# EAGLE design Carolo_20200123 (EAGLE 7.7.0)
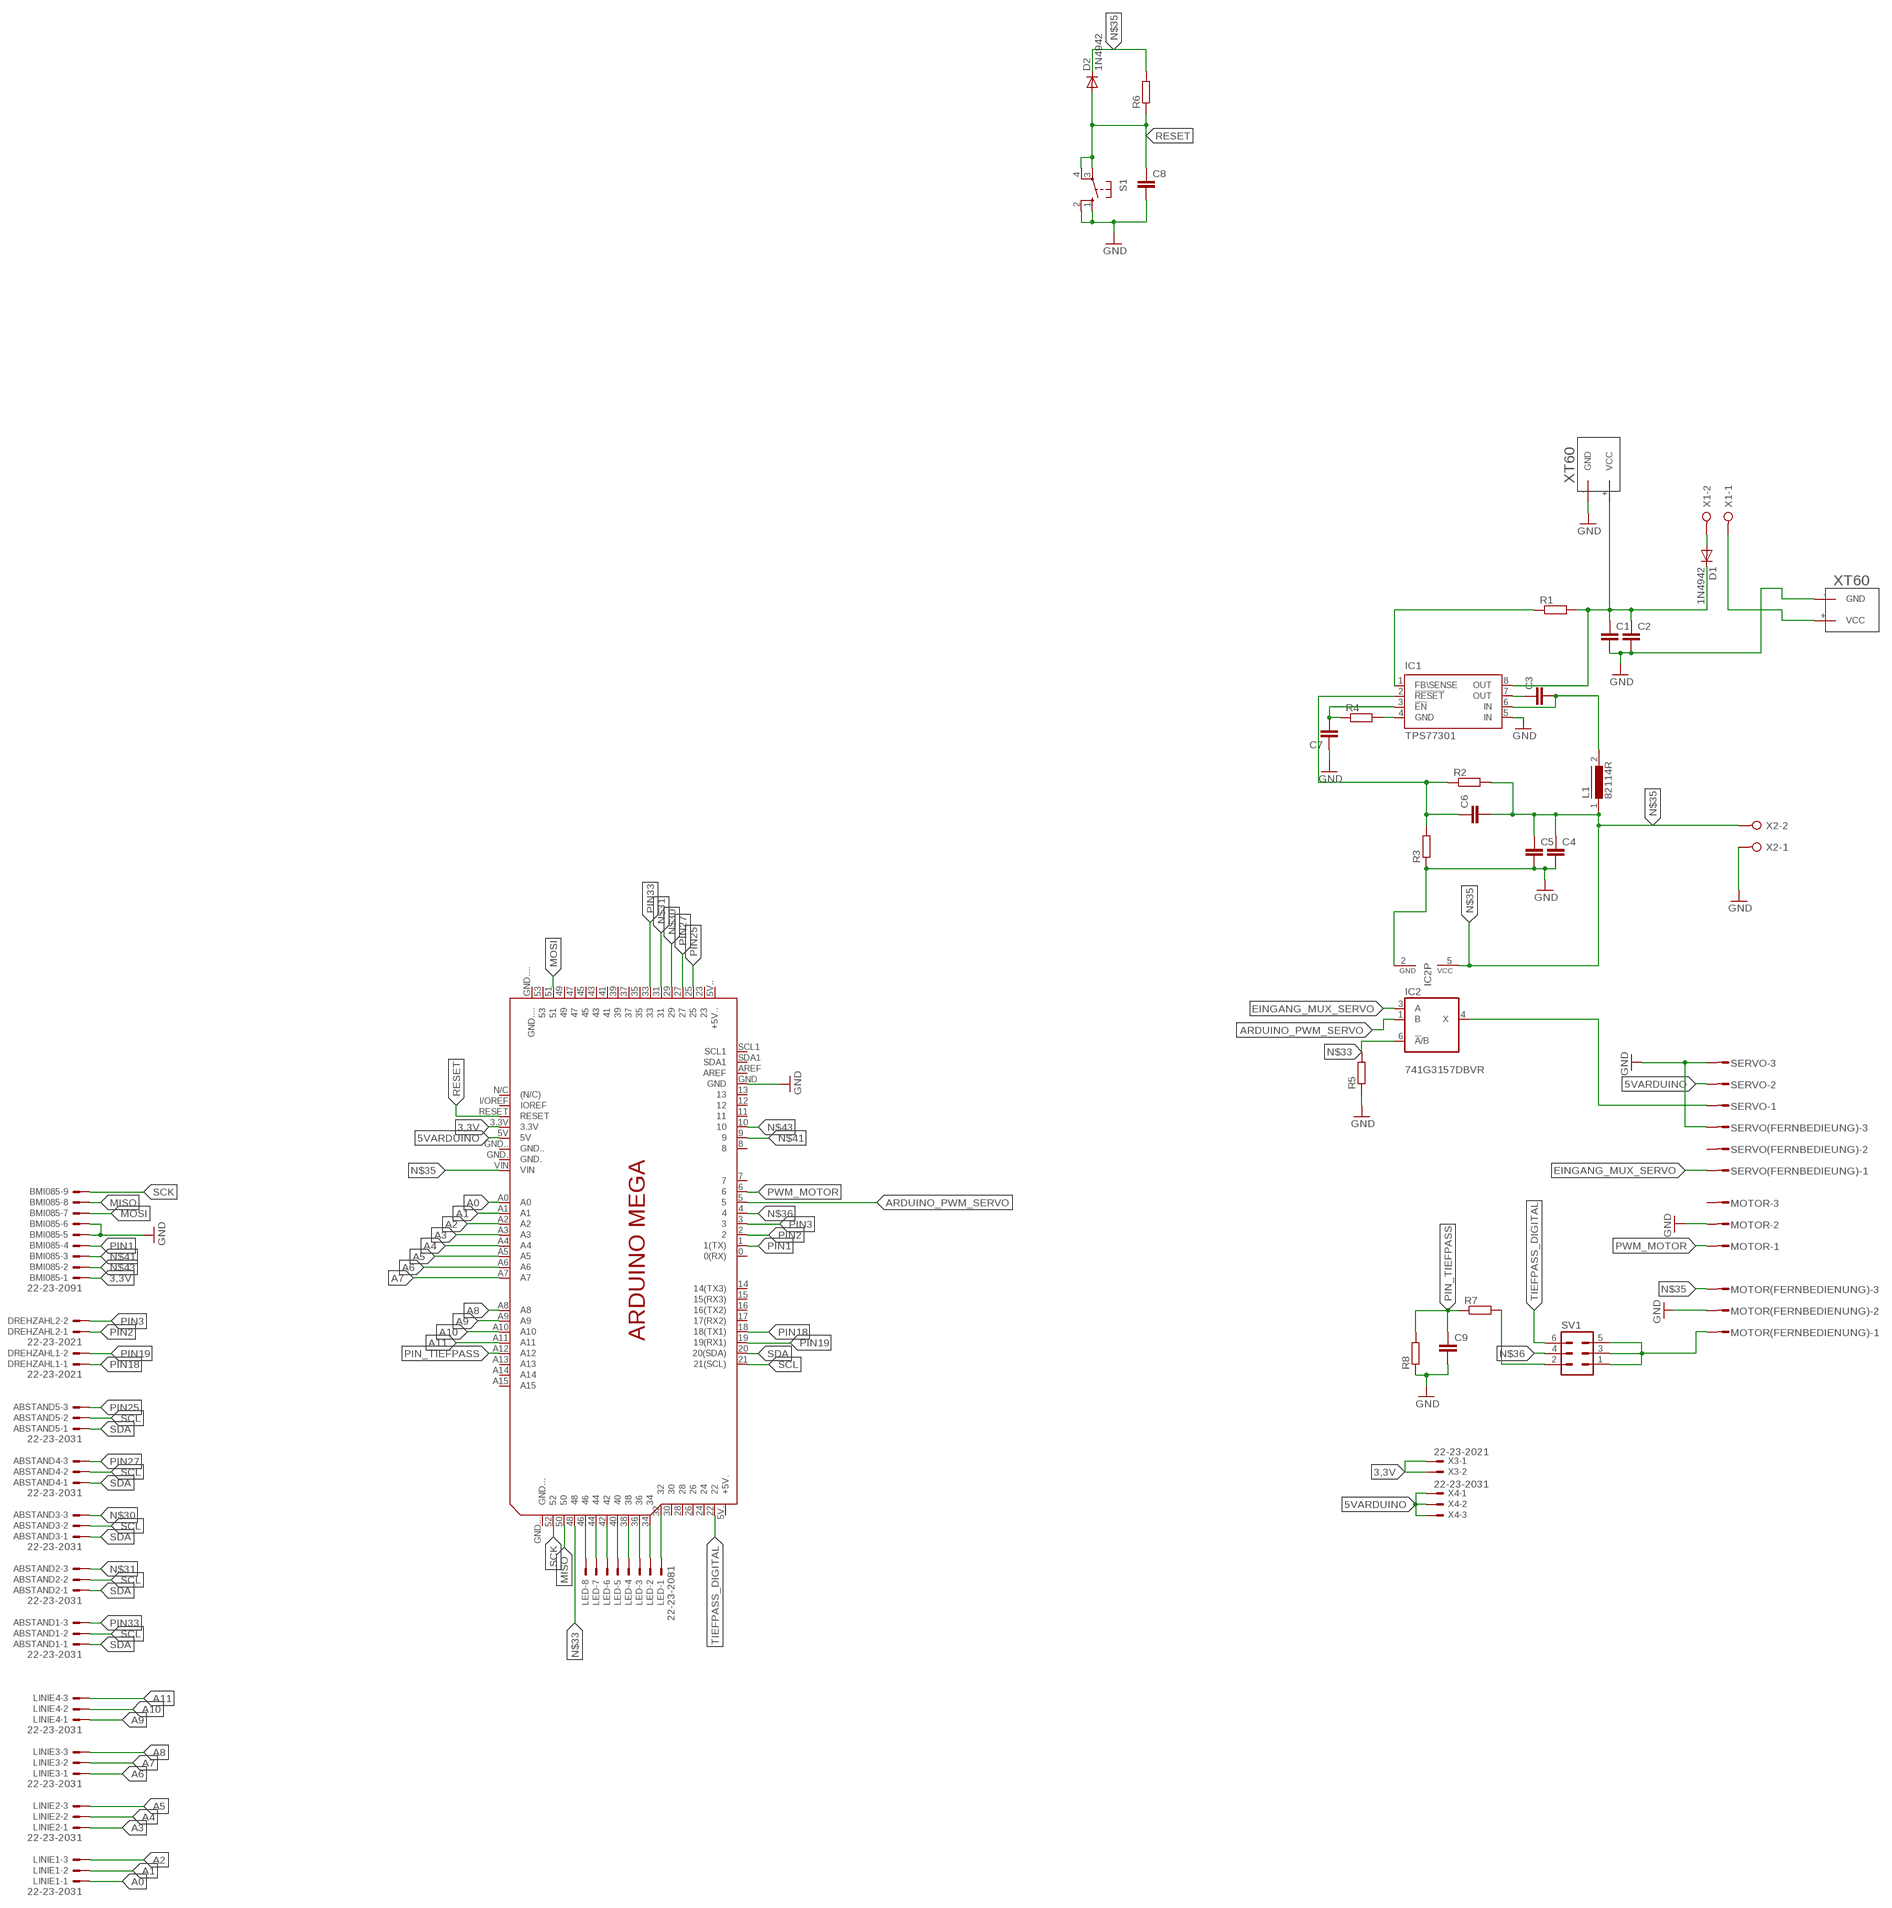
[diagram p0: schematic, sheet 1]

## Parts
ABSTAND1  22-23-2031  [22-23-2031]
ABSTAND2  22-23-2031  [22-23-2031]
ABSTAND3  22-23-2031  [22-23-2031]
ABSTAND4  22-23-2031  [22-23-2031]
ABSTAND5  22-23-2031  [22-23-2031]
BMI085  22-23-2091  [22-23-2091]
C1  C2,5-3  [C2.5-3]
C2  C2,5-3  [C2.5-3]
C3  C2,5-3  [C2.5-3]
C4  C2,5-3  [C2.5-3]
C5  C2,5-3  [C2.5-3]
C6  C2,5-3  [C2.5-3]
C7  C2,5-3  [C2.5-3]
C8  C2,5-3  [C2.5-3]
C9  C2,5-3  [C2.5-3]
D1  1N4942  [DO41-10]
D2  1N4942  [DO41-10]
DREHZAHL1  22-23-2021  [22-23-2021]
DREHZAHL2  22-23-2021  [22-23-2021]
IC1  TPS77301  [SOP-08]
IC2  741G3157DBVR  [DBV_R-PDSO-G6]
L1  82114R  [82114R]
LED  22-23-2081  [22-23-2081]
LINIE1  22-23-2031  [22-23-2031]
LINIE2  22-23-2031  [22-23-2031]
LINIE3  22-23-2031  [22-23-2031]
LINIE4  22-23-2031  [22-23-2031]
MOTOR  L03P  [L03P]
MOTOR(FERNBEDIENUNG)  L03P  [L03P]
PCB1  ARDUINO_MEGA  [ARDUINO_MEGA]
R1  R-EU_0411/15  [0411/15]
R2  R-EU_0411/15  [0411/15]
R3  R-EU_0411/15  [0411/15]
R4  R-EU_0411/15  [0411/15]
R5  R-EU_0411/15  [0411/15]
R6  R-EU_0411/15  [0411/15]
R7  R-EU_0411/15  [0411/15]
R8  R-EU_0411/15  [0411/15]
S1  10-XX  [B3F-10XX]
SERVO  L03P  [L03P]
SERVO(FERNBEDIEUNG)  L03P  [L03P]
SV1  ML6  [ML6]
U$1  XT60  [XT60]
U$2  XT60  [XT60]
X1  W237-02P  [W237-132]
X2  W237-02P  [W237-132]
X3  22-23-2021  [22-23-2021]
X4  22-23-2031  [22-23-2031]

## Nets
3,3V: BMI085.1 PCB1.3.3V X3.1 X3.2
5VARDUINO: PCB1.5V SERVO.2 X4.1 X4.2 X4.3
A0: LINIE1.1 PCB1.A0
A1: LINIE1.2 PCB1.A1
A2: LINIE1.3 PCB1.A2
A3: LINIE2.1 PCB1.A3
A4: LINIE2.2 PCB1.A4
A5: LINIE2.3 PCB1.A5
A6: LINIE3.1 PCB1.A6
A7: LINIE3.2 PCB1.A7
A8: LINIE3.3 PCB1.A8
A9: LINIE4.1 PCB1.A9
A10: LINIE4.2 PCB1.A10
A11: LINIE4.3 PCB1.A11
ARDUINO_PWM_SERVO: IC2.1(B) PCB1.5
EINGANG_MUX_SERVO: IC2.3(A) SERVO(FERNBEDIEUNG).1
GND: BMI085.5 BMI085.6 C1.2 C2.2 C4.2 C5.2 C7.1 C8.2 C9.2 IC1.5(IN) IC2.2(GND) MOTOR(FERNBEDIENUNG).2 MOTOR.2 PCB1.GND R3.1 R5.1 R8.1 S1.1(S) S1.2(S1) SERVO(FERNBEDIEUNG).3 SERVO.3 U$1.-(GND) U$2.-(GND) X2.1
MISO: BMI085.8 PCB1.50
MOSI: BMI085.7 PCB1.51
N$1: U$1.+(VCC) X1.1
N$4: R7.2 SV1.2
N$5: C6.1 IC1.2(!RESET) R2.1 R3.2
N$6: C3.1 IC1.7(OUT)
N$8: MOTOR(FERNBEDIENUNG).1 SV1.1 SV1.3 SV1.5
N$9: LED.1 PCB1.32
N$10: C3.2 IC1.6(IN) L1.2
N$12: C7.2 IC1.3(!EN) R4.1
N$13: IC2.4(X) SERVO.1
N$14: LED.2 PCB1.34
N$15: LED.3 PCB1.36
N$16: LED.4 PCB1.38
N$17: LED.5 PCB1.40
N$18: LED.6 PCB1.42
N$19: LED.7 PCB1.44
N$20: LED.8 PCB1.46
N$23: IC1.4(GND) R4.2
N$24: D1.A X1.2
N$27: C1.1 C2.1 D1.C IC1.8(OUT) R1.2 U$2.+(VCC)
N$30: ABSTAND3.3 PCB1.29
N$31: ABSTAND2.3 PCB1.31
N$32: IC1.1(FB\SENSE) R1.1
N$33: IC2.6(!A!/B) PCB1.48 R5.2
N$35: C4.1 C5.1 C6.2 D2.C IC2.5(VCC) L1.1 MOTOR(FERNBEDIENUNG).3 PCB1.VIN R2.2 R6.2 X2.2
N$36: PCB1.4 SV1.4
N$41: BMI085.3 PCB1.9
N$43: BMI085.2 PCB1.10
PIN1: BMI085.4 PCB1.1(1(TX))
PIN2: DREHZAHL2.1 PCB1.2
PIN3: DREHZAHL2.2 PCB1.3
PIN18: DREHZAHL1.1 PCB1.18(18(TX1))
PIN19: DREHZAHL1.2 PCB1.19(19(RX1))
PIN25: ABSTAND5.3 PCB1.25
PIN27: ABSTAND4.3 PCB1.27
PIN33: ABSTAND1.3 PCB1.33
PIN_TIEFPASS: C9.1 PCB1.A12 R7.1 R8.2
PWM_MOTOR: MOTOR.1 PCB1.6
RESET: C8.1 D2.A PCB1.RESET R6.1 S1.3(P) S1.4(P1)
SCK: BMI085.9 PCB1.52
SCL: ABSTAND1.2 ABSTAND2.2 ABSTAND3.2 ABSTAND4.2 ABSTAND5.2 PCB1.21(21(SCL))
SDA: ABSTAND1.1 ABSTAND2.1 ABSTAND3.1 ABSTAND4.1 ABSTAND5.1 PCB1.20(20(SDA))
TIEFPASS_DIGITAL: PCB1.22 SV1.6
Unconnected: MOTOR.3 PCB1.0(0(RX)) PCB1.5V.(+5V.) PCB1.5V..(+5V..) PCB1.7 PCB1.8 PCB1.11 PCB1.12 PCB1.13 PCB1.14(14(TX3)) PCB1.15(15(RX3)) PCB1.16(16(TX2)) PCB1.17(17(RX2)) PCB1.23 PCB1.24 PCB1.26 PCB1.28 PCB1.30 PCB1.35 PCB1.37 PCB1.39 PCB1.41 PCB1.43 PCB1.45 PCB1.47 PCB1.49 PCB1.53 PCB1.A13 PCB1.A14 PCB1.A15 PCB1.AREF PCB1.GND. PCB1.GND.. PCB1.GND... PCB1.GND.... PCB1.I/OREF(IOREF) PCB1.N/C((N/C)) PCB1.SCL1 PCB1.SDA1 SERVO(FERNBEDIEUNG).2

## Library data of the parts
ABSTAND1-ABSTAND5 LINIE1-LINIE4 X4 = con-molex:22-23-2031: .100" (2.54mm) Center Header - 3 Pin; MF: MOLEX; MPN: 22-23-2031; OC_FARNELL: 1462950; OC_NEWARK: 30C0862
BMI085 = con-molex:22-23-2091: .100" (2.54mm) Center Header - 9 Pin; MF: MOLEX; MPN: 22-23-2091; OC_FARNELL: 1756827; OC_NEWARK: 56H0450
C1-C9 = capacitor-wima:C: CAPACITOR naming: grid - package width
D1 D2 = diode:1N4942: DIODE 1.0 A, 200 V, 150 ns
DREHZAHL1 DREHZAHL2 X3 = con-molex:22-23-2021: .100" (2.54mm) Center Header - 2 Pin; MF: MOLEX; MPN: 22-23-2021; OC_FARNELL: 1462926; OC_NEWARK: 25C3832
IC1 = texas:TPS773*: 250-mA LDO REGULATORS WITH RESET OUTPUT WITH 8-PIN MSOP PACKAGING Source: http://focus.ti.com/lit/ds/symlink/tps77333.pdf; MF: TEXAS INSTRUMENT CONNECTORS; MPN: TPS77301DGK; OC_FARNELL: 1510194; OC_NEWARK: 77C1213
IC2 = 74xx-little-us:74*1G3157: Single-Pole, Double-Throw Analog Switch Source: http://focus.ti.com/lit/ds/symlink/sn74lvc1g3157.pdf
L1 = inductors:82114R: INDUCTOR
LED = con-molex:22-23-2081: .100" (2.54mm) Center Header - 8 Pin; MF: MOLEX; MPN: 22-23-2081; OC_FARNELL: 1756826; OC_NEWARK: 01C7592
MOTOR MOTOR(FERNBEDIENUNG) SERVO SERVO(FERNBEDIEUNG) = con-amp-mt:L03P: AMP MT CONNECTOR; OC_FARNELL: unknown; OC_NEWARK: unknown
PCB1 = Arduino_:ARDUINO_MEGA: Device for representing an Arduino Mega board with a footprint in an EAGLE design. Created by Dave Young for Element14. More EAGLE documentation at: http://www.element14.com/community/community/knode/cadsoft_eagle
R1-R8 = resistor:R-EU_: RESISTOR, European symbol
S1 = switch-omron:10-XX: OMRON SWITCH; MPN: B3F-1000; OC_FARNELL: 176432; OC_NEWARK: 36M3542
SV1 = con-harting-ml:ML6: HARTING; OC_FARNELL: unknown; OC_NEWARK: unknown
U$1 U$2 = XT60:XT60: XT60
X1 X2 = con-wago-508:W237-02P: WAGO SREW CLAMP; OC_FARNELL: unknown; OC_NEWARK: unknown

## Board
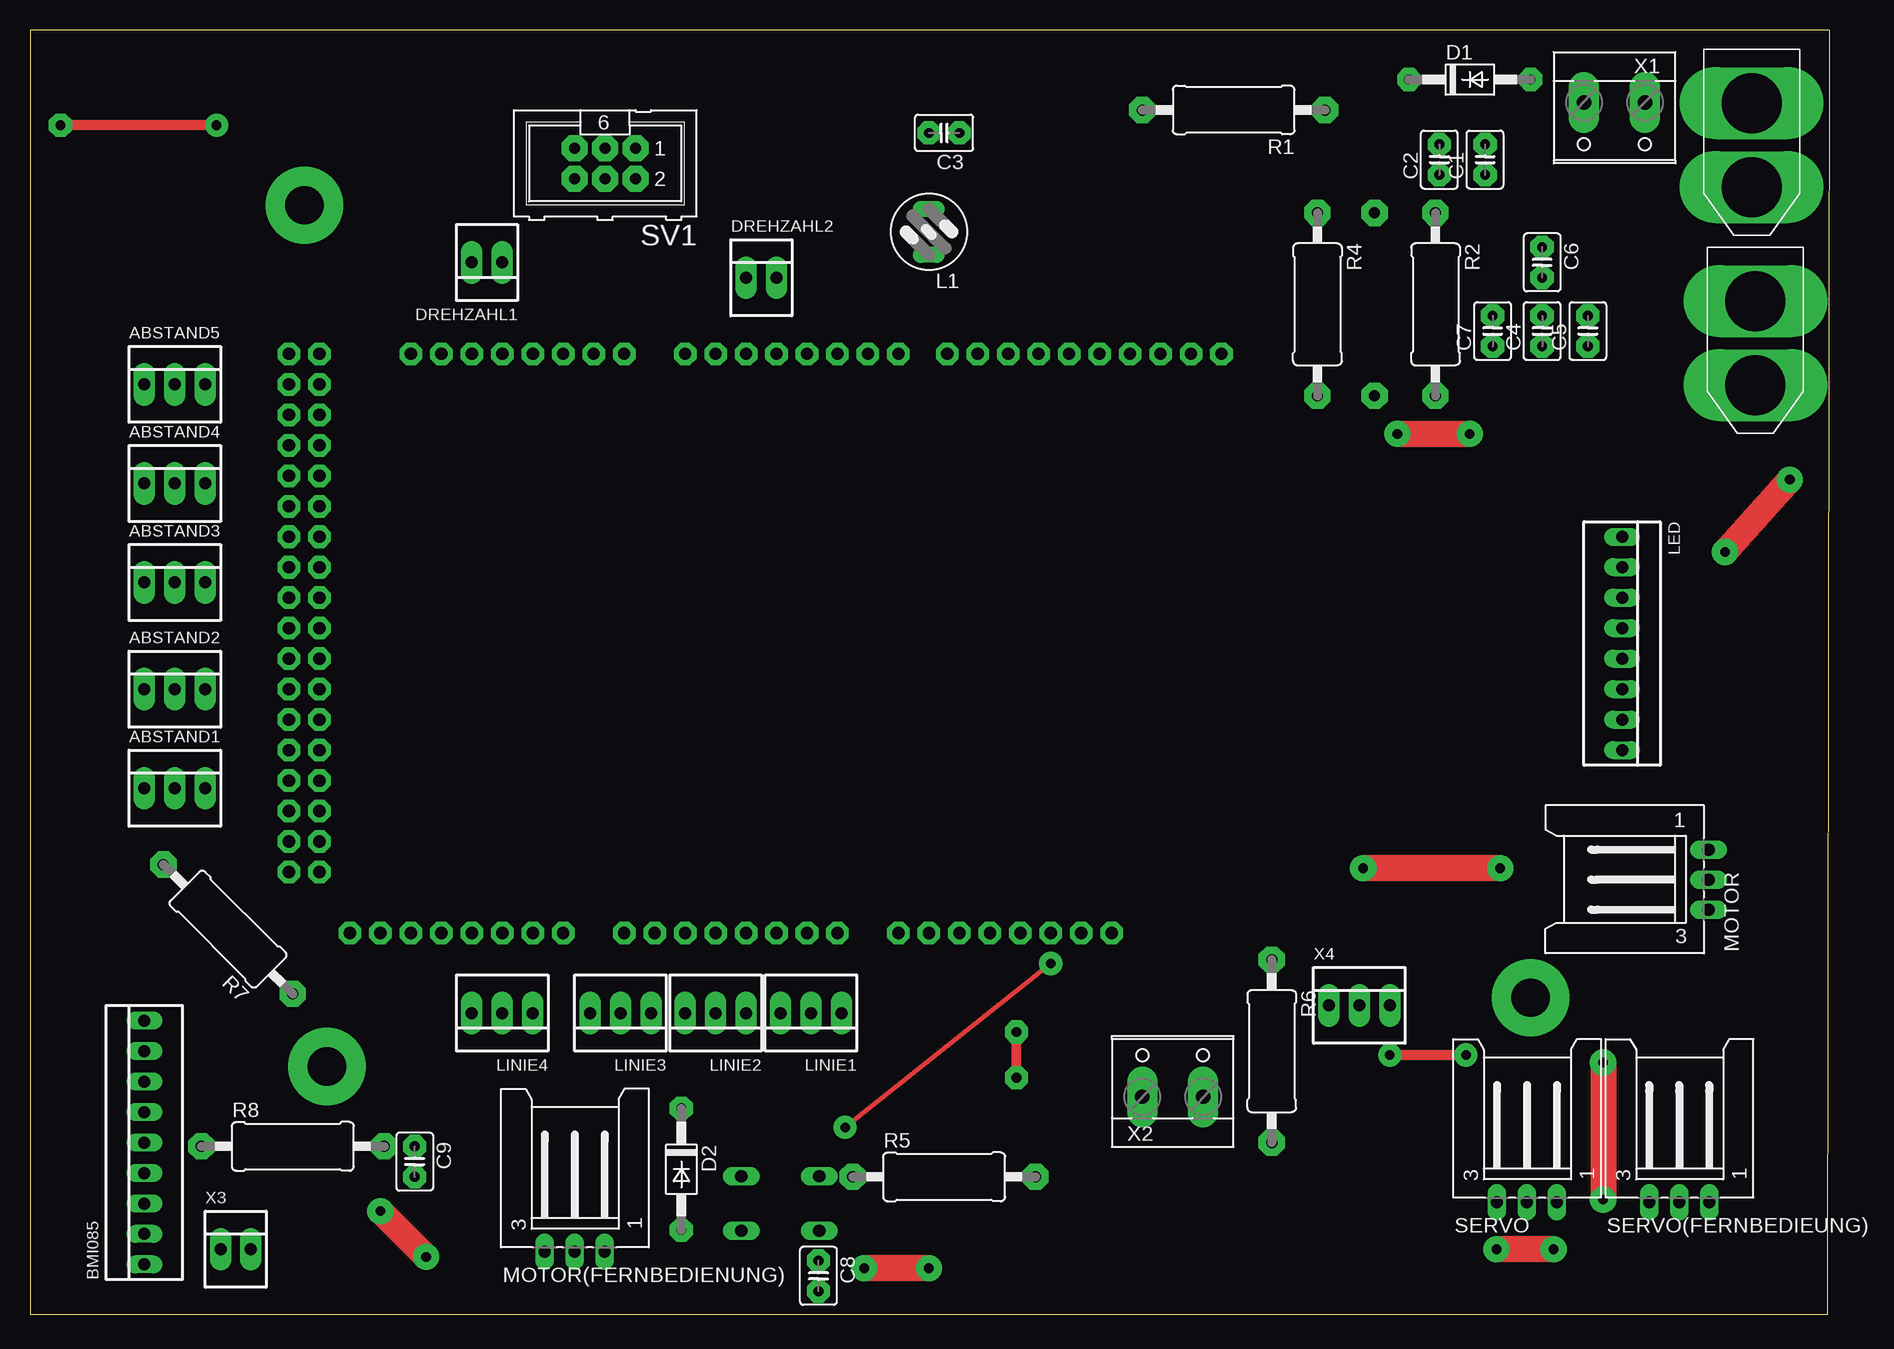
[diagram p1: board, top side]
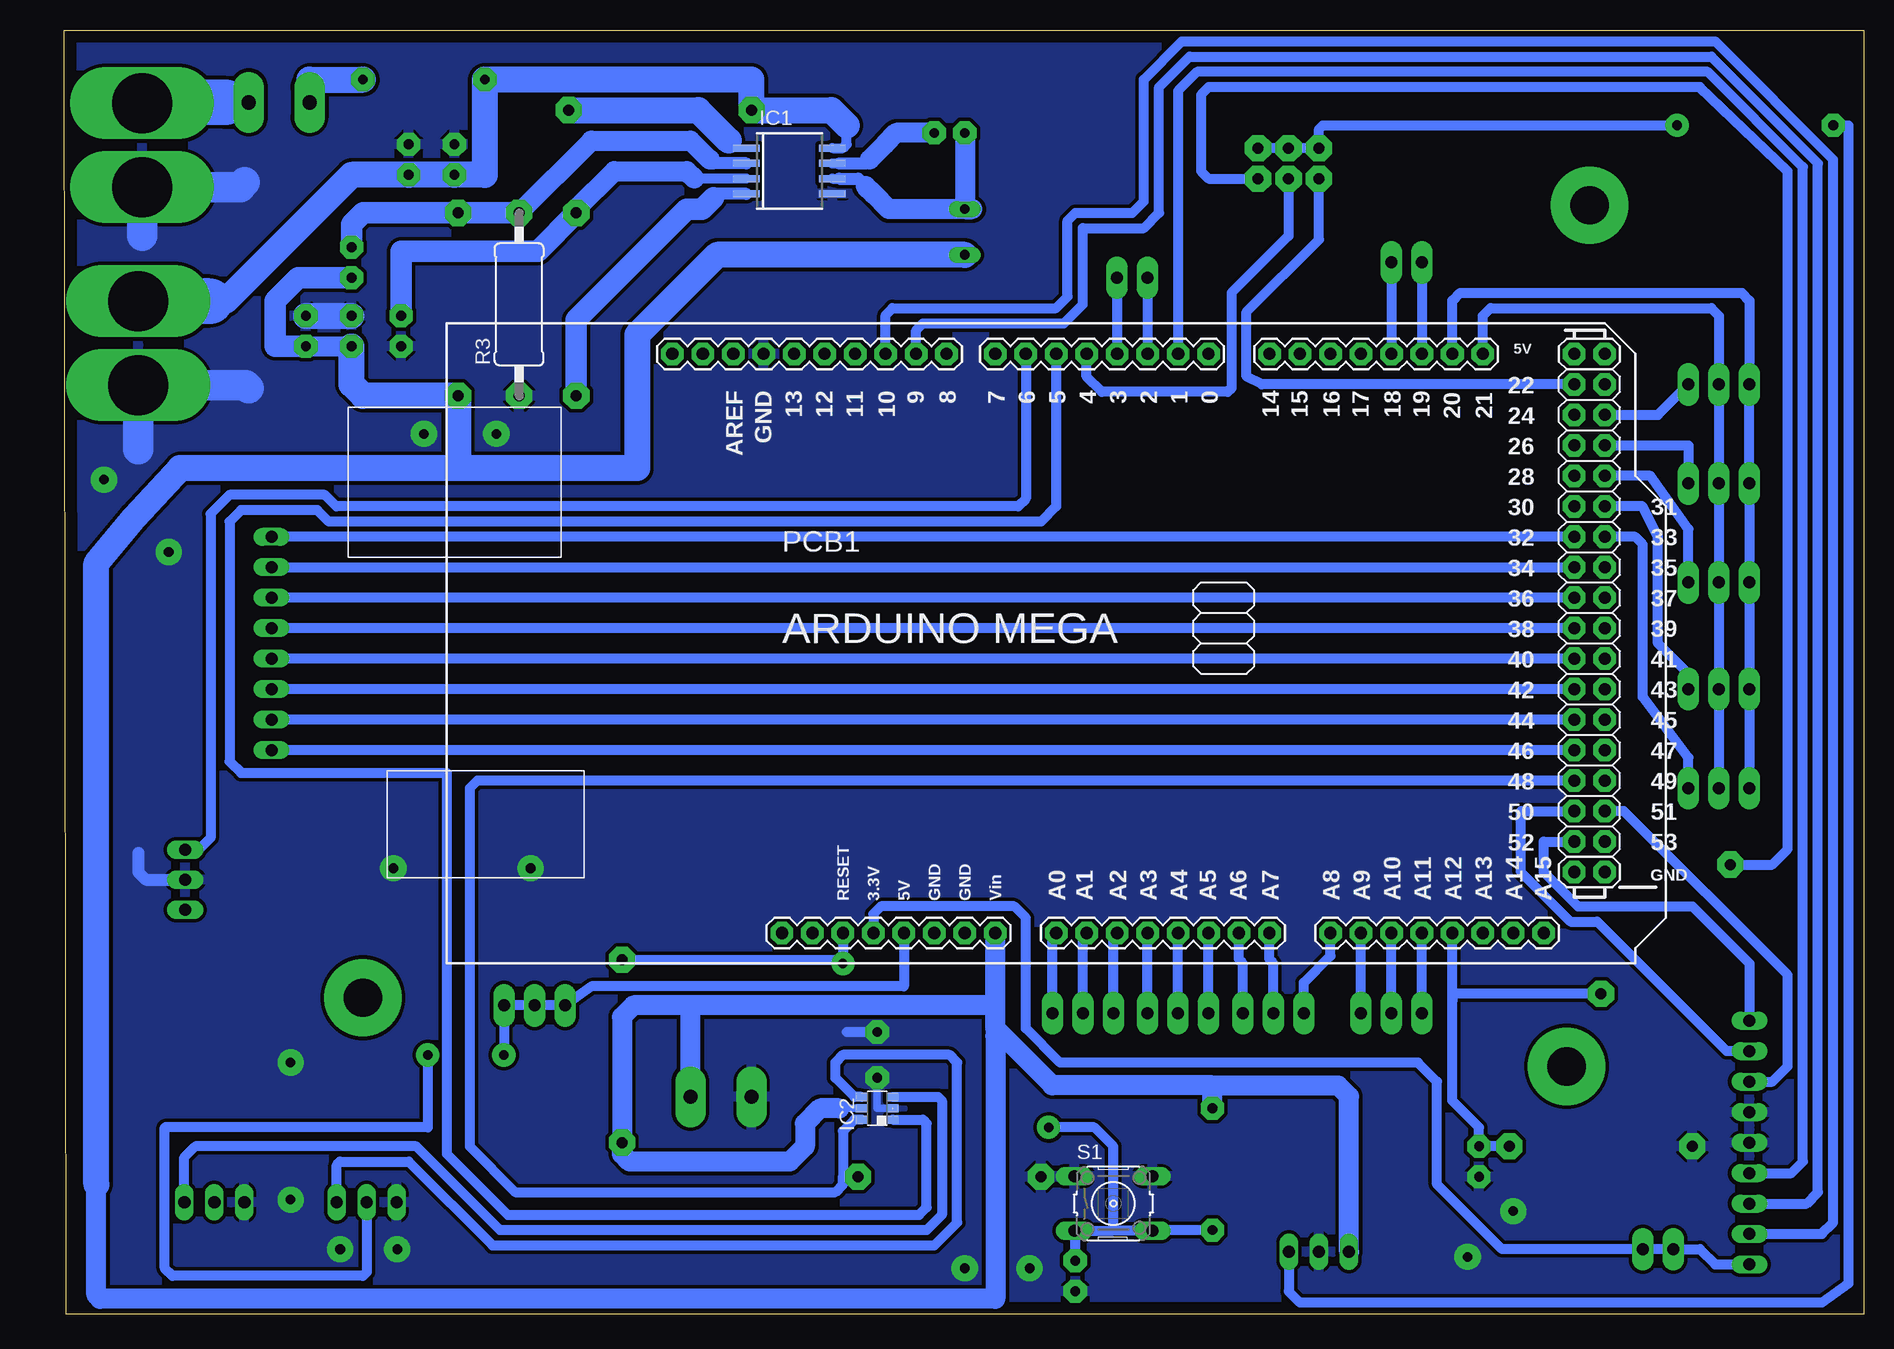
[diagram p2: board, bottom side, seen from below]

Size 150 x 107 mm. Coordinates in mm from the lower left corner, seen from the top.
Outline: 0,0 149.84,0 150,107 0,107 0,0
Copper layers (1*16): Top 0.035mm / dielectric 1.5mm / Bottom 0.035mm
Design rules "default": minimum track width 10mil, minimum drill 24mil, track to track 8mil, track to pad 8mil, pad to pad 8mil, via to via 8mil, smd to smd 8mil, copper to edge 40mil, drill to drill 8mil, minimum pad ring 10mil, minimum via ring 8mil, stop-mask expansion 4mil, vias tented up to drill 0mil, thermal gap 10mil

### Footprints (pad centres in the part's own frame; a part is rotated, then mirrored left to right if it is on the bottom)
22-23-2031 = drill 1 pad 1.778 long: 1 -2.54,0; 2 0,0; 3 2.54,0
22-23-2091 = drill 1 long: 1 -10.16,0; 2 -7.62,0; 3 -5.08,0; 4 -2.54,0; 5 0,0; 6 2.54,0; 7 5.08,0; 8 7.62,0; 9 10.16,0
C2.5-3 = drill 0.813 pad 1.93 octagon: 1 -1.27,0; 2 1.27,0
DO41-10 = drill 0.8 pad 1.93 octagon: A 5.08,0; C -5.08,0
22-23-2021 = drill 1 pad 1.778 long: 1 -1.27,0; 2 1.27,0
SOP-08 = smd 0.6 x 2.2: 1 -1.905,-3.6; 2 -0.635,-3.6; 3 0.635,-3.6; 4 1.905,-3.6; 5 1.905,3.575; 6 0.635,3.575; 7 -0.635,3.575; 8 -1.905,3.575
DBV_R-PDSO-G6 = smd 0.69 x 0.99: 1 -0.95,-1.29; 2 0,-1.29; 3 0.95,-1.29; 4 0.95,1.3; 5 0,1.3; 6 -0.95,1.3
82114R = drill 0.813 long: 1 0,1.905; 2 0,-1.905
22-23-2081 = drill 1 long: 1 -8.89,0; 2 -6.35,0; 3 -3.81,0; 4 -1.27,0; 5 1.27,0; 6 3.81,0; 7 6.35,0; 8 8.89,0
L03P = drill 1.016 long: 1 2.5,-6.25; 2 0,-6.25; 3 -2.5,-6.25
ARDUINO_MEGA = drill 1.016 pad 1.88 octagon: 0 63.5,50.8; 1 60.96,50.8; 2 58.42,50.8; 3 55.88,50.8; 3.3V 35.56,2.54; 4 53.34,50.8; 5 50.8,50.8; 5V 38.1,2.54; 5V. 93.98,50.8; 5V.. 96.52,50.8; 6 48.26,50.8; 7 45.72,50.8; 8 41.656,50.8; 9 39.116,50.8; 10 36.576,50.8; 11 34.036,50.8; 12 31.496,50.8; 13 28.956,50.8; 14 68.58,50.8; 15 71.12,50.8; 16 73.66,50.8; 17 76.2,50.8; 18 78.74,50.8; 19 81.28,50.8; 20 83.82,50.8; 21 86.36,50.8; 22 93.98,48.26; 23 96.52,48.26; 24 93.98,45.72; 25 96.52,45.72; 26 93.98,43.18; 27 96.52,43.18; 28 93.98,40.64; 29 96.52,40.64; 30 93.98,38.1; 31 96.52,38.1; 32 93.98,35.56; 33 96.52,35.56; 34 93.98,33.02; 35 96.52,33.02; 36 93.98,30.48; 37 96.52,30.48; 38 93.98,27.94; 39 96.52,27.94; 40 93.98,25.4; 41 96.52,25.4; 42 93.98,22.86; 43 96.52,22.86; 44 93.98,20.32; 45 96.52,20.32; 46 93.98,17.78; 47 96.52,17.78; 48 93.98,15.24; 49 96.52,15.24; 50 93.98,12.7; 51 96.52,12.7; 52 93.98,10.16; 53 96.52,10.16; A0 50.8,2.54; A1 53.34,2.54; A2 55.88,2.54; A3 58.42,2.54; A4 60.96,2.54; A5 63.5,2.54; A6 66.04,2.54; A7 68.58,2.54; A8 73.66,2.54; A9 76.2,2.54; A10 78.74,2.54; A11 81.28,2.54; A12 83.82,2.54; A13 86.36,2.54; A14 88.9,2.54; A15 91.44,2.54; AREF 23.876,50.8; GND 26.416,50.8; GND. 43.18,2.54; GND.. 40.64,2.54; GND... 93.98,7.62; GND.... 96.52,7.62; I/OREF 30.48,2.54; N/C 27.94,2.54; RESET 33.02,2.54; SCL1 18.796,50.8; SDA1 21.336,50.8; VIN 45.72,2.54
0411/15 = drill 0.914 pad 2.184 octagon: 1 -7.62,0; 2 7.62,0
B3F-10XX = drill 1.016 long: 1 -3.251,2.261; 2 3.251,2.261; 3 -3.251,-2.261; 4 3.251,-2.261
ML6 = drill 0.914 pad 2.184 octagon: 1 -2.54,-1.27; 2 -2.54,1.27; 3 0,-1.27; 4 0,1.27; 5 2.54,-1.27; 6 2.54,1.27
XT60 = drill 5 long: + 4.5,0; - 11.5,0
W237-132 = drill 1.194 pad 2.54 long: 1 -2.54,-0.635; 2 2.54,-0.635

### Placement (x,y rotation side)
ABSTAND1  12.06,43.81 0 top
ABSTAND2  12.06,52.07 0 top
ABSTAND3  12.06,60.96 0 top
ABSTAND4  12.06,69.22 0 top
ABSTAND5  12.06,77.47 0 top
BMI085  9.53,14.29 90 top
C1  121.28,96.2 90 top
C2  117.47,96.2 90 top
C3  76.2,98.42 180 top
C4  126.05,81.92 90 top
C5  129.86,81.92 90 top
C6  126.05,87.63 270 top
C7  121.92,81.92 90 top
C8  65.72,3.17 270 top
C9  32.07,12.7 270 top
D1  120.02,102.87 0 top
D2  54.29,12.06 270 top
DREHZAHL1  38.1,87.63 180 top
DREHZAHL2  60.96,86.36 0 top
IC1  89.53,95.25 270 bottom
IC2  82.23,17.14 90 bottom
L1  74.93,90.17 180 top
LED  132.72,55.88 270 top
LINIE1  65.09,25.08 180 top
LINIE2  57.15,25.08 180 top
LINIE3  49.21,25.08 180 top
LINIE4  39.37,25.08 180 top
MOTOR  133.67,36.2 90 top
MOTOR(FERNBEDIENUNG)  45.4,11.43 0 top
PCB1  118.11,29.21 0 bottom
R1  100.33,100.33 180 top
R2  117.16,84.14 270 top
R3  112.08,84.14 90 bottom
R4  107.31,84.14 270 top
R5  76.2,11.43 0 top
R6  103.5,21.91 270 top
R7  16.51,32.07 135 top
R8  21.91,13.97 0 top
S1  62.55,9.21 0 bottom
SERVO  124.78,15.56 0 top
SERVO(FERNBEDIEUNG)  137.48,15.56 0 top
SV1  47.94,95.89 180 top
U$1  143.51,105.41 270 top
U$2  143.83,88.9 270 top
X1  132.08,100.33 180 top
X2  95.25,18.73 0 top
X3  17.14,5.4 0 top
X4  110.81,25.72 0 top

### Tracks (layer width: path | path; a pad name or v marks a point on that pad's centre or on a via)
3,3V
  Bottom 0.813: PCB1.3.3V 82.55,33.34 81.92,33.97 70.8,33.97 69.85,33.02 69.85,23.81 66.99,20.95 37.15,20.95 35.56,19.37 35.56,10.79 30.16,5.4 X3.2 X3.1 13.65,5.4 12.38,4.13 BMI085.1
5VARDUINO  (via drill 0.8 pad 1.93)
  Top 0.813: v113.35,21.59 v119.7,21.59
  Bottom 0.813: PCB1.5V 80.01,27.3 106.05,27.3 X4.1 X4.2 X4.3 v113.35,21.59 | v119.7,21.59 119.7,15.56 141.6,15.56 141.6,3.81 140.97,3.17 125.09,3.17 124.78,3.49 SERVO.2
A0
  Bottom 0.813: LINIE1.1 67.63,31.43 PCB1.A0
A1
  Bottom 0.813: LINIE1.2 65.09,31.43 PCB1.A1
A2
  Bottom 0.813: LINIE1.3 62.55,31.43 PCB1.A2
A3
  Bottom 0.813: LINIE2.1 PCB1.A3
A4
  Bottom 0.813: LINIE2.2 PCB1.A4
A5
  Bottom 0.813: LINIE2.3 PCB1.A5
A6
  Bottom 0.813: LINIE3.1 51.75,29.21 52.07,29.53 PCB1.A6
A7
  Bottom 0.813: LINIE3.2 49.21,29.21 49.53,29.53 PCB1.A7
A8
  Bottom 0.813: LINIE3.3 46.67,27.62 44.45,29.84 PCB1.A8
A9
  Bottom 0.813: LINIE4.1 PCB1.A9
A10
  Bottom 0.813: LINIE4.2 PCB1.A10
A11
  Bottom 0.813: LINIE4.3 PCB1.A11
ARDUINO_PWM_SERVO
  Bottom 0.813: PCB1.5 67.31,67.31 68.58,66.04 127.95,66.04 128.91,66.99 135.25,66.99 136.21,66.04 136.21,46.04 135.25,45.09 118.11,45.09 118.11,13.34 113.03,8.26 78.74,8.26 78.11,8.89 78.11,15.88 78.42,16.2 IC2.1
EINGANG_MUX_SERVO
  Bottom 0.813: IC2.3 77.15,18.09 76.83,17.78 76.83,8.26 78.11,6.99 113.67,6.99 120.65,13.97 139.06,13.97 139.98,13.06 SERVO(FERNBEDIEUNG).1
GND  (via drill 0.8 pad 1.93, 0.8 pad 2.18)
  Top 0.813: v82.23,19.68 v82.23,23.5
  Top 2.184: v113.98,73.34 v120.02,73.34 | v146.69,69.53 v141.29,63.5 | v127,5.4 v122.24,5.4 | v122.56,37.15 v111.12,37.15 | v74.93,3.81 v69.53,3.81 | v29.21,8.57 v33.02,4.76 | v131.13,20.95 v131.13,9.53
  Bottom 0.61: IC2.2 82.23,17.14 v82.23,19.68
  Bottom 0.813: v82.23,23.5 84.77,23.5
  Bottom 1.016: 143.83,38.42 143.83,36.83 143.19,36.2 140.02,36.2
  Bottom 2.184: C5.2 C4.2
  Bottom 2.54: 134.94,94.3 135.32,93.91 U$1.- 143.51,89.85 | 134.62,77.15 134.87,77.4 U$2.- 143.83,72.07
  pour Bottom (isolate 0.305): -2.54,109.86 153.03,109.86 153.03,-3.81 -2.54,-3.81
MISO
  Bottom 0.813: PCB1.50 28.57,41.91 28.57,36.83 24.45,32.7 22.23,32.7 11.43,21.91 BMI085.8
MOSI
  Bottom 0.813: BMI085.7 7.62,19.37 6.35,20.64 6.35,28.26 20,41.91 PCB1.51
N$1
  Bottom 2.54: X1.1 136.53,100.97
  Bottom 3.81: 136.53,100.97 143.46,100.97 U$1.+
N$4
  Bottom 0.813: R7.2 7.63,37.46 6.35,38.73 6.35,95.25 13.65,102.23 54.61,102.23 55.24,101.6 55.24,95.25 54.61,94.61 SV1.2
N$5
  Bottom 1.016: IC1.2 95.89,95.89 96.2,96.2
  Bottom 1.676: R3.2 106.05,97.79 97.79,97.79 96.2,96.2
  Bottom 1.778: C6.1 126.05,90.81 125.09,91.76 R2.1 R3.2
N$6
  Bottom 0.813: IC1.7 85.41,95.89
  Bottom 1.016: 85.41,95.89 83.19,95.89 81.6,97.47
  Bottom 1.676: C3.1 80.64,98.42 81.6,97.47 82.87,96.2
N$8  (via drill 0.8 pad 1.93)
  Top 0.813: v15.56,99.06 v2.54,99.06
  Bottom 0.813: SV1.1 SV1.3 SV1.5 45.4,98.74 45.09,99.06 v15.56,99.06 | MOTOR(FERNBEDIENUNG).1 47.9,1.95 47.94,1.91 46.99,0.95 3.49,0.95 1.27,2.54 1.27,99.06 v2.54,99.06
N$9
  Bottom 0.813: PCB1.32 LED.1
N$10
  Bottom 0.813: IC1.6 85.41,94.61
  Bottom 1.016: 85.41,94.61 83.82,94.61 82.55,93.34
  Bottom 1.676: C3.2 L1.2 | L1.2 74.3,92.08 | L1.2 81.28,92.08 82.55,93.34 83.19,93.98
N$12
  Bottom 0.813: IC1.3 97.47,94.61
  Bottom 1.676: R4.1 107.31,92.08 104.14,95.25 98.11,95.25 97.47,94.61
  Bottom 1.778: C7.2 121.92,88.58 110.49,88.58 R4.1
N$13
  Bottom 0.813: SERVO.1 127.28,12.42 127,12.7 121.28,12.7 114.3,5.71 77.47,5.71 75.56,7.62 75.56,20.95 76.2,21.59 85.09,21.59 85.72,20.95 85.72,19.68 84.14,18.09 IC2.4
N$14
  Bottom 0.813: LED.2 PCB1.34
N$15
  Bottom 0.813: PCB1.36 LED.3
N$16
  Bottom 0.813: PCB1.38 LED.4
N$17
  Bottom 0.813: PCB1.40 LED.5
N$18
  Bottom 0.813: PCB1.42 LED.6
N$19
  Bottom 0.813: PCB1.44 LED.7
N$20
  Bottom 0.813: PCB1.46 LED.8
N$23
  Bottom 1.016: IC1.4 95.57,93.34 95.89,93.03
  Bottom 1.778: R4.2 107.31,82.87 98.11,92.08 96.84,92.08 95.89,93.03
N$24
  Bottom 2.184: X1.2 129.54,102.87 D1.A
N$25  (via drill 3.2 pad 6.45)
  other vias: 125.09,26.35
N$27
  Bottom 0.813: IC1.8 85.09,97.16 84.77,97.47 84.77,99.06 84.77,99.38
  Bottom 2.184: 84.77,99.06 86.04,100.33 R1.2 92.71,102.87 D1.C 114.94,94.93 C2.1 C1.1 126.05,94.93 136.53,84.45 138.11,84.45
  Bottom 3.81: U$2.+ 137.85,84.4 138.11,84.45
N$30
  Bottom 0.813: ABSTAND3.3 14.61,65.41 17.78,69.85 PCB1.29
N$31
  Bottom 0.813: ABSTAND2.3 14.61,53.34 17.14,55.88 17.14,64.77 18.41,67.31 PCB1.31
N$32
  Bottom 0.61: IC1.1 94.61,97.16
  Bottom 0.813: 94.61,97.16 94.61,97.79
  Bottom 2.184: R1.1 97.16,100.33 94.61,97.79
N$33
  Bottom 0.813: PCB1.48 115.57,44.45 116.2,43.81 116.2,13.97 112.39,10.16 85.72,10.16 85.09,10.79 85.09,11.43 | IC2.6 84.14,16.2 85.09,15.24 85.09,11.43 | 85.09,11.43 R5.2
N$35
  Bottom 0.61: IC2.5 85.41,17.14
  Bottom 0.813: 72.71,25.72 72.71,23.5 72.39,23.18
  Bottom 1.676: 72.71,25.72 97.79,25.72 | 97.79,25.72 102.55,25.72 103.5,24.77 R6.2 103.5,13.34 102.87,12.7 89.53,12.7 88.27,13.97 88.27,15.88 87,17.14 85.41,17.14 | 54.29,19.05 67.63,19.05 72.39,23.81 | C5.1 C4.1 | 72.39,23.81 PCB1.VIN | D2.C 54.29,19.05 | 72.39,23.81 72.39,23.18 72.39,1.27 147,1.27 147.32,1.59 147.32,10.79 | X2.2 97.79,25.72 | MOTOR(FERNBEDIENUNG).3 42.9,18.14 43.81,19.05 54.29,19.05
  Bottom 1.778: C5.1 132.4,80.64 132.4,84.45 130.49,86.36 C6.2
  Bottom 2.184: 147.32,10.79 147.32,62.55 144.15,66.36 140.34,70.48 117.16,70.48 | L1.1 95.57,88.27 102.23,81.6 102.23,70.48 117.16,70.48 | 117.16,70.48 R2.2 125.09,76.52 126.05,77.47 C4.1
N$36
  Bottom 0.813: SV1.4 47.94,89.85 52.7,85.09 52.7,77.15 53.02,76.83 63.5,76.83 64.77,78.11 PCB1.4
N$39  (via drill 3.2 pad 6.45)
  other vias: 22.86,92.39
N$40  (via drill 3.2 pad 6.45)
  other vias: 24.77,20.64
N$41
  Bottom 0.813: BMI085.3 4.76,9.21 3.81,10.16 3.81,95.89 12.7,104.78 56.2,104.78 58.74,102.23 58.74,91.76 60.01,90.49 65.09,90.49 65.09,84.14 66.67,82.55 78.42,82.55 78.99,81.98 PCB1.9
N$43
  Bottom 0.813: BMI085.2 3.49,6.67 2.54,7.62 2.54,96.2 12.38,106.05 56.83,106.05 60.01,102.87 60.01,92.71 60.96,91.76 65.72,91.76 66.36,91.12 66.36,84.77 67.31,83.82 80.96,83.82 81.53,83.25 PCB1.10
PIN1
  Bottom 0.813: PCB1.1 57.15,101.92 55.56,103.5 13.02,103.5 5.08,95.57 5.08,12.7 6.03,11.75 BMI085.4
PIN2
  Bottom 0.813: DREHZAHL2.1 PCB1.2
PIN3
  Bottom 0.813: DREHZAHL2.2 PCB1.3
PIN18
  Bottom 0.813: DREHZAHL1.1 PCB1.18
PIN19
  Bottom 0.813: DREHZAHL1.2 PCB1.19
PIN25
  Bottom 0.813: PCB1.25 17.14,74.93 ABSTAND5.3
PIN27
  Bottom 0.813: PCB1.27 14.61,72.39 ABSTAND4.3
PIN33
  Bottom 0.813: ABSTAND1.3 14.61,46.35 18.41,51.44 18.41,64.14 19.05,64.77 PCB1.33
PIN_TIEFPASS
  Bottom 0.813: R8.2 C9.1 32.07,15.56 34.29,17.78 34.29,26.04 | 34.29,26.04 PCB1.A12 | R7.1 34.28,26.68 34.29,26.04
PWM_MOTOR
  Bottom 0.813: PCB1.6 69.85,67.94 70.48,67.31 127.32,67.31 128.27,68.26 136.21,68.26 137.79,66.67 137.79,39.69 138.79,38.7 MOTOR.1
RESET  (via drill 0.8 pad 1.93)
  Top 0.406: v67.94,15.56 v85.09,29.21
  Bottom 0.813: PCB1.RESET 85.09,29.53 | 85.09,29.53 v85.09,29.21 | 62.55,6.99 62.55,13.97 64.14,15.56 v67.94,15.56 | R6.1 85.09,29.53 | D2.A 59.26,6.99 S1.4 62.51,6.95 62.55,6.99 | 62.55,6.99 62.59,6.95 S1.3 65.72,6.87 C8.1
SCK
  Bottom 0.813: PCB1.52 26.67,39.37 26.67,36.83 23.81,33.97 14.29,33.97 9.53,29.21 BMI085.9
SCL
  Bottom 0.813: ABSTAND1.2 ABSTAND2.2 ABSTAND3.2 ABSTAND4.2 ABSTAND5.2 12.06,83.19 12.7,83.82 31.11,83.82 31.75,83.19 PCB1.21
SDA
  Bottom 0.813: ABSTAND1.1 ABSTAND2.1 ABSTAND3.1 ABSTAND4.1 ABSTAND5.1 9.53,84.45 10.16,85.09 33.66,85.09 34.29,84.45 PCB1.20
TIEFPASS_DIGITAL
  Bottom 0.813: PCB1.22 50.16,77.47 51.44,78.11 51.44,83.5 45.4,89.53 SV1.6